# EAGLE schematic piezo-preamp-tickler_V0-9a (EAGLE 7.5.0)
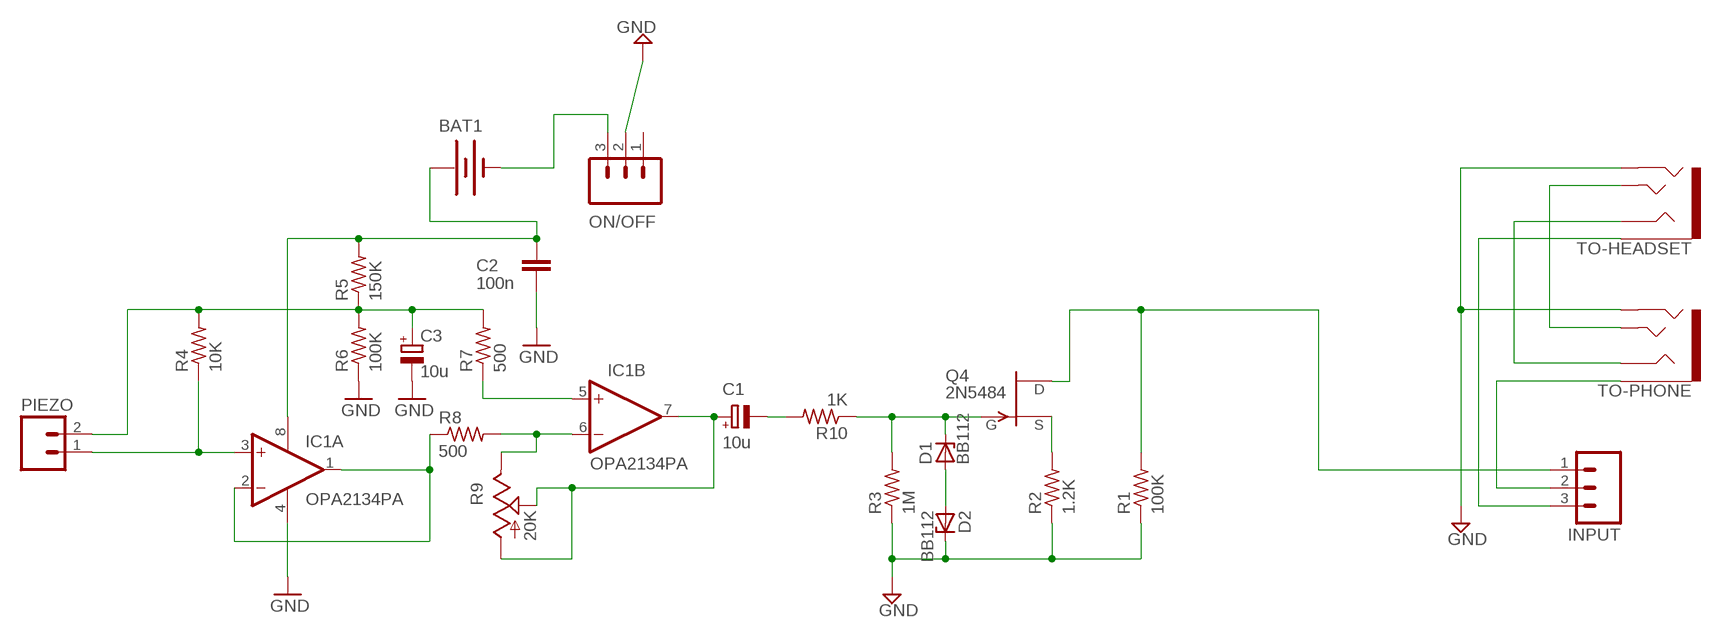
[diagram p0: schematic, sheet 1]

## Parts
BAT1  BATTERYA23  [BATTERY-A23]
C1  10u  CPOL-EUE2.5-5  [E2,5-5]
C2  100n  C-EU025-025X050  [C025-025X050]
C3  10u  CPOL-EUE2.5-5  [E2,5-5]
D1  BB112  ZENER-DIODEZD-2.5  [ZDIO-2.5]
D2  BB112  ZENER-DIODEZD-2.5  [ZDIO-2.5]
IC1  OPA2134PA  [DIL08]
INPUT  M03SINGLE-POLE-DOUBLE-THROW  [SPDT-SWITCH]
ON/OFF  labl  M03SINGLE-POLE-DOUBLE-THROW  [SPDT-SWITCH]
PIEZO  M02LOCK  [1X02_LOCK]
Q4  2N5484  [TO92-]
R1  100K  R-US_0204/2V  [0204V]
R2  1.2K  R-US_0204/2V  [0204V]
R3  1M  R-US_0204/2V  [0204V]
R4  10K  R-US_0204/2V  [0204V]
R5  150K  R-US_0204/2V  [0204V]
R6  100K  R-US_0204/2V  [0204V]
R7  500  R-US_0204/2V  [0204V]
R8  500  R-US_0204/2V  [0204V]
R9  20K  TRIMPOT-BOURNS  [BOURNS-TRIMPOT-3309W1]
R10  1K  R-US_0204/2V  [0204V]
TO-HEADSET  AUDIO-JACK3LGPADS  [AUDIO-JACK-TRRS-SMD]
TO-PHONE  AUDIO-JACK3LGPADS  [AUDIO-JACK-TRRS-SMD]

## Nets
`DEL: INPUT.1 Q4.3(D) R1.2
GND: C2.1 C3.- D2.C IC1.4(A:V-) ON/OFF.2 R1.1 R2.1 R3.1 R6.1 TO-HEADSET.RING2 TO-PHONE.RING2
N$1: D1.A D2.A
N$2: BAT1.GND@1(-) ON/OFF.3
N$3: Q4.2(S) R2.2
N$5: IC1.5(B:+IN) R7.1
N$6: C1.+ IC1.7(B:OUT) R9.P$1(IN) R9.P$2(WIPER)
N$7: IC1.6(B:-IN) R8.2 R9.P$3(OUT)
N$8: C3.+ PIEZO.2 R4.2 R5.1 R6.2 R7.2
N$9: IC1.3(A:+IN) PIEZO.1 R4.1
N$10: D1.C Q4.1(G) R3.2 R10.1
N$11: C1.- R10.2
N$12: INPUT.3 TO-HEADSET.EARTH
N$13: TO-HEADSET.TIP TO-PHONE.TIP
N$14: IC1.1(A:OUT) IC1.2(A:-IN) R8.1
N$15: TO-HEADSET.RING1 TO-PHONE.RING1
TO-PHONE: INPUT.2 TO-PHONE.EARTH
V9V: BAT1.PWR@1(+) C2.2 IC1.8(A:V+) R5.2
Unconnected: ON/OFF.1

## Library data of the parts
BAT1 = Daniel:BATTERY: Battery Holders Various common sizes : AA, AAA, 18650 (PRT-12895), 20mm coin cell and 12mm coin cell. 20MM_4LEGS, BATT-10373
C1 C3 = rcl:CPOL-EU: POLARIZED CAPACITOR, European symbol
C2 = rcl:C-EU: CAPACITOR, European symbol
D1 D2 = diode:ZENER-DIODE: Z-Diode
IC1 = linear:OPA2*: Dual Operational Amplifier Low Power, Single-Supply, Rail-To-Rail Operational Amplifier Source: http://focus.ti.com/lit/ds/symlink/opa2345.pdf http://focus.ti.com .. opa241.pdf http://focus.ti.com/lit/ds/symlink/opa2134.pdf
INPUT ON/OFF = Daniel:M03: Single Pole Double Throw Switch 2.0mm pitch 3-pin header for switch.
PIEZO = SparkFun-Connectors:M02: Header 2 Standard 2-pin 0.1" header. Use with straight break away headers (SKU : PRT-00116), right angle break away headers (PRT-00553), swiss pins (PRT-00743), machine pins (PRT-00117), and female headers (PRT-00115). Molex polarized connector foot print use with SKU : PRT-08233 with associated crimp pins and housings.
Q4 = transistor-fet:?548*: N-Channel JFETs Source: VISHAY 2N5484.pdf Compatible: TO92 2N5245 J304 J305 U310 J308 J309 J310 TO72 2N4416 2N4416A 2N3823 2N4351 3N169 3N170 3N171 MFE3002 TO18 2N3796 2N3797 MFE825 Source: Motorola European Master Guide Pacge 3-59
R1-R8 R10 = CMU-ArtFab:R-US_: RESISTOR, American symbol
R9 = CMU-ArtFab:TRIMPOT-BOURNS; THIS: 20K
TO-HEADSET TO-PHONE = Daniel:AUDIO-JACK3: Audio jack - 3.5mm TRRS variety - two rings.

## Net classes
0 default: width 0.152 mm, clearance 0.2 mm